# EAGLE design VS1000 (EAGLE 6.1)
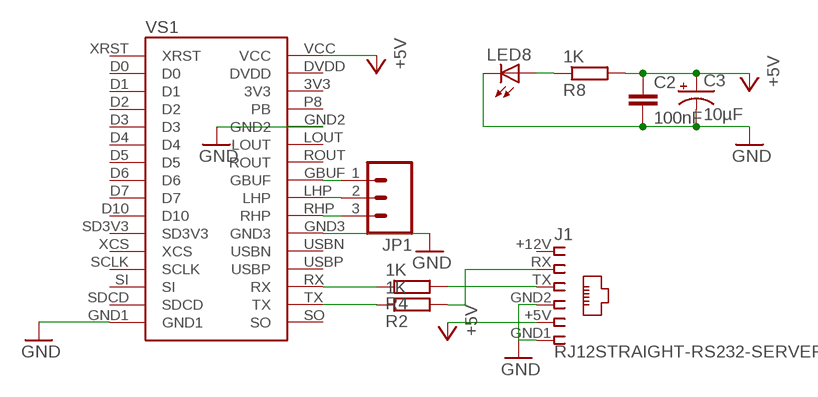
[diagram p0: schematic, sheet 1]

## Parts
C2  100nF  C-EUC1206  [C1206]
C3  10µF  CAP_POL1206  [EIA3216]
J1  RJ12STRAIGHT-RS232-SERVER  [RJ12-STRAIGHT-RS232]
JP1  M03LONGPADS  [1X03_LONGPADS]
LED8  LED3MM  [LED3MM]
R2  1K  R-EU_M1206  [M1206]
R4  1K  R-EU_M1206  [M1206]
R8  1K  R-EU_M1206  [M1206]
VS1  VS1000  [VS1000]

## Nets
+5V [highpower]: C2.1 C3.A(+) J1.+5V R8.2 VS1.VCC
GND [highpower]: C2.2 C3.C(-) J1.GND1 J1.GND2 LED8.K(C) VS1.GND1 VS1.GND2 VS1.GND3
N$1: R4.1 VS1.RX
N$3: JP1.1 VS1.GBUF
N$4: R2.1 VS1.TX
N$5: JP1.2 VS1.LHP
N$7: JP1.3 VS1.RHP
N$10: J1.RX R2.2
N$11: J1.TX R4.2
N$23: LED8.A R8.1
Unconnected: VS1.3V3 VS1.D0 VS1.D1 VS1.D2 VS1.D3 VS1.D4 VS1.D5 VS1.D6 VS1.D7 VS1.D10 VS1.DVDD VS1.LOUT VS1.P8(PB) VS1.ROUT VS1.SDCD VS1.SO VS1.USBN VS1.USBP VS1.XRST

## Power pins joined to a net without a drawn wire
1: J1.+12V
SCLK: VS1.SCLK
SD3V3: VS1.SD3V3
SI: VS1.SI
XCS: VS1.XCS

## Library data of the parts
C2 = rcl:C-EU: CAPACITOR, European symbol
C3 = SparkFun:CAP_POL: Capacitor Polarized These are standard SMD and PTH capacitors. Normally 10uF, 47uF, and 100uF in electrolytic and tantalum varieties. Always verify the external diameter of the through hole cap, it varies with capacity, voltage, and manufacturer. The EIA devices should be standard.
J1 = lpatiny:RJ12: CORCOM Modular RJ Jacks No Shield Source: www.tycoelectronics.com .. ENG_DS_1654001_1099_RJ_L_0507.pdf
JP1 = SparkFun:M03: Header 3 Standard 3-pin 0.1" header. Use with straight break away headers (SKU : PRT-00116), right angle break away headers (PRT-00553), swiss pins (PRT-00743), machine pins (PRT-00117), and female headers (PRT-00115). Molex polarized connector foot print use with SKU : PRT-08232 with associated crimp pins and housings.
LED8 = lpatiny:LED3MM
R2 R4 R8 = resistor:R-EU_: RESISTOR, European symbol
VS1 = lpatiny:VS1000: Arduino Nano I/O pin arrangement

## Net classes
0 default: width 0.61 mm
1 power: width 0.914 mm
2 highpower: width 1.372 mm

## Board
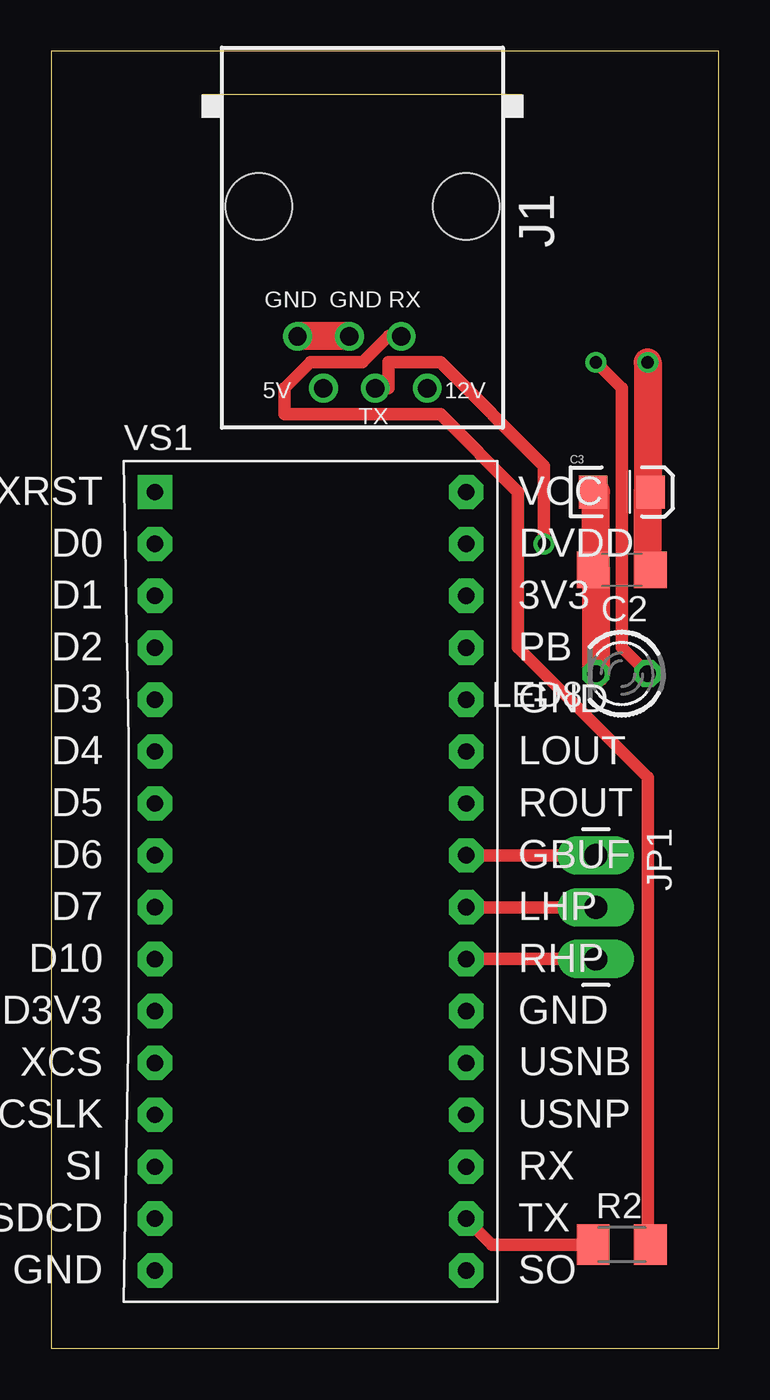
[diagram p1: board, top side]
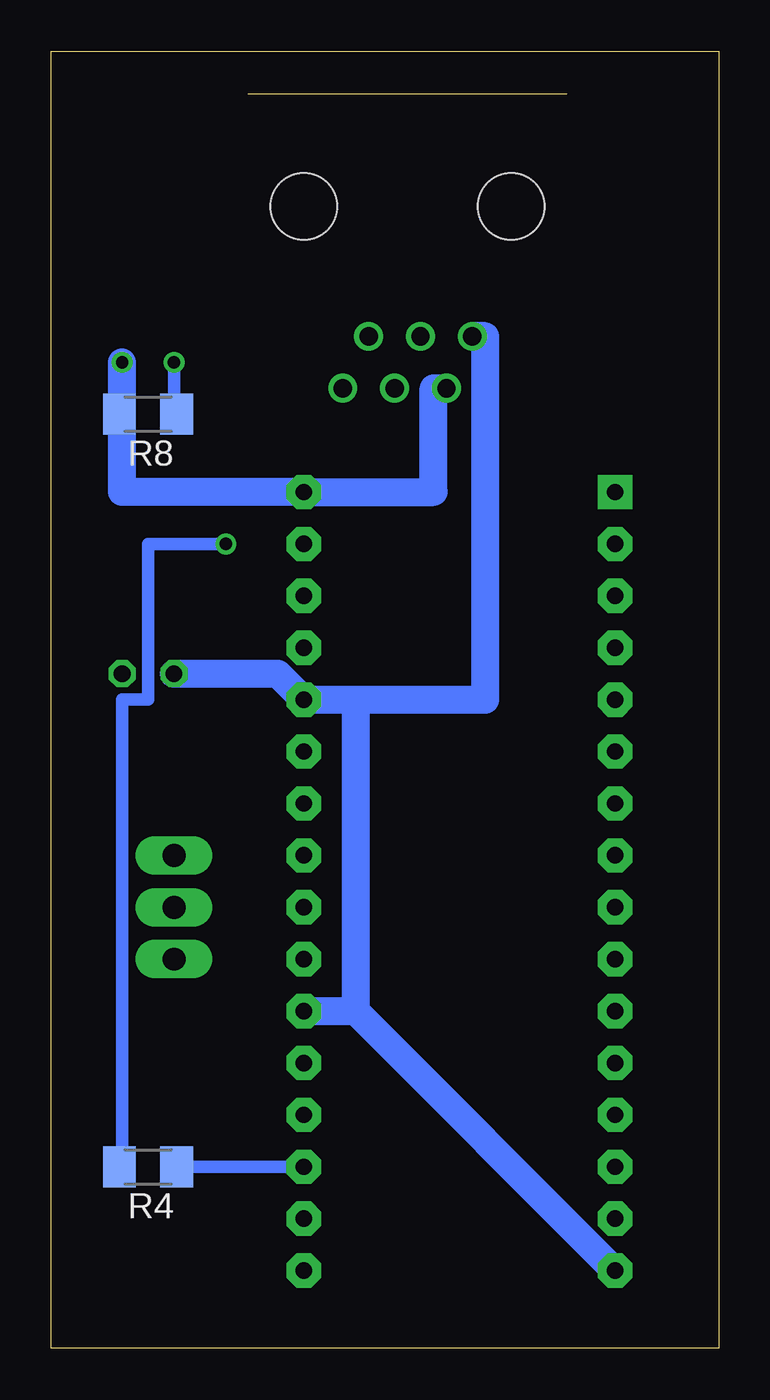
[diagram p2: board, bottom side, seen from below]

Size 32.69 x 63.49 mm. Coordinates in mm from the lower left corner, seen from the top.
Outline: 0,0 32.69,0 32.69,63.49 0,63.49 0,0
Copper layers (1*16): Top 0.035mm / dielectric 1.5mm / Bottom 0.035mm
Design rules: minimum track width 10mil, minimum drill 24mil, track to track 8mil, track to pad 8mil, pad to pad 8mil, via to via 8mil, smd to smd 8mil, copper to edge 40mil, drill to drill 8mil, minimum pad ring 10mil, minimum via ring 8mil, stop-mask expansion 4mil, vias tented up to drill 0mil, thermal gap 10mil

### Footprints (pad centres in the part's own frame; a part is rotated, then mirrored left to right if it is on the bottom)
C1206 = smd 1.6 x 1.8: 1 -1.4,0; 2 1.4,0
EIA3216 = smd 1.4 x 1.6: A 1.4,0; C -1.4,0
RJ12-STRAIGHT-RS232 = drill 0.9 pad 1.4: +5V 1.905,8.89; +12V -3.175,8.89; GND1 3.175,6.35; GND2 0.635,6.35; RX -1.905,6.35; TX -0.635,8.89 | hole 3.251: -5.08,0; 5.08,0
1X03_LONGPADS = drill 1.118 pad 1.88 long: 1 0,0; 2 2.54,0; 3 5.08,0
LED3MM = drill 0.813 octagon: A -1.27,0; K 1.27,0
M1206 = smd 1.6 x 2: 1 -1.4,0; 2 1.4,0
VS1000 = drill 0.8 pad 1.676 octagon: 3V3 15.24,-7.62; D0 0,-5.08; D1 0,-7.62; D2 0,-10.16; D3 0,-12.7; D4 0,-15.24; D5 0,-17.78; D6 0,-20.32; D7 0,-22.86; D10 0,-25.4; DVDD 15.24,-5.08; GBUF 15.24,-20.32; GND1 0,-40.64; GND2 15.24,-12.7; GND3 15.24,-27.94; LHP 15.24,-22.86; LOUT 15.24,-15.24; P8 15.24,-10.16; RHP 15.24,-25.4; ROUT 15.24,-17.78; RX 15.24,-35.56; SCLK 0,-33.02; SD3V3 0,-27.94; SDCD 0,-38.1; SI 0,-35.56; SO 15.24,-40.64; TX 15.24,-38.1; USBN 15.24,-30.48; USBP 15.24,-33.02; VCC 15.24,-2.54; XCS 0,-30.48 | drill 0.8 pad 1.676 square: XRST 0,-2.54

### Placement (x,y rotation side)
C2  27.94,38.1 180 top
C3  27.94,41.91 0 top
J1  15.24,55.88 180 top
JP1  26.67,24.13 270 top
LED8  27.94,33.02 180 top
R2  27.94,5.08 0 top
R4  27.94,8.89 180 bottom
R8  27.94,45.72 180 bottom
VS1  5.08,44.45 0 top

### Tracks (layer width: path | path; a pad name or v marks a point on that pad's centre or on a via)
+5V  (via drill 0.61)
  Top 1.372: 29.21,41.91 29.21,38.1 C2.1 | v29.21,48.26 29.21,41.91 | 29.21,41.91 C3.A
  Bottom 1.372: 29.21,45.72 29.21,41.91 VS1.VCC 13.97,41.91 13.97,46.99 J1.+5V | 29.21,45.72 v29.21,48.26 | 29.21,45.72 R8.2
GND
  Top 1.372: J1.GND2 J1.GND1 | 26.67,38.1 26.67,41.91 C3.C | 26.67,38.1 LED8.K | 26.67,38.1 C2.2
  Bottom 1.372: 17.78,16.51 VS1.GND1 | VS1.GND3 17.78,16.51 | LED8.K 21.59,33.02 VS1.GND2 17.78,31.75 | 17.78,31.75 11.43,31.75 11.43,49.53 J1.GND1 | 17.78,31.75 17.78,16.51
N$1
  Bottom 0.61: VS1.RX R4.1 26.67,8.89
N$3
  Top 0.61: JP1.1 VS1.GBUF
N$4
  Top 0.61: VS1.TX 21.59,5.08 R2.1 26.67,5.08
N$5
  Top 0.61: JP1.2 VS1.LHP
N$7
  Top 0.61: JP1.3 VS1.RHP
N$10
  Top 0.61: R2.2 29.21,5.08 29.21,27.94 22.86,34.29 22.86,41.91 19.05,45.72 11.43,45.72 11.43,46.99 12.7,48.26 15.24,48.26 16.51,49.53 J1.RX
N$11  (via drill 0.61)
  Top 0.61: v24.13,39.37 24.13,43.18 19.05,48.26 16.51,48.26 16.51,46.99 J1.TX
  Bottom 0.61: v24.13,39.37 27.94,39.37 27.94,31.75 29.21,31.75 29.21,8.89 R4.2
N$23  (via drill 0.61)
  Top 0.61: v26.67,48.26 27.94,46.99 27.94,34.29 LED8.A
  Bottom 0.61: v26.67,48.26 26.67,45.72 R8.1